# Altium project Relay_Board.PrjPcb
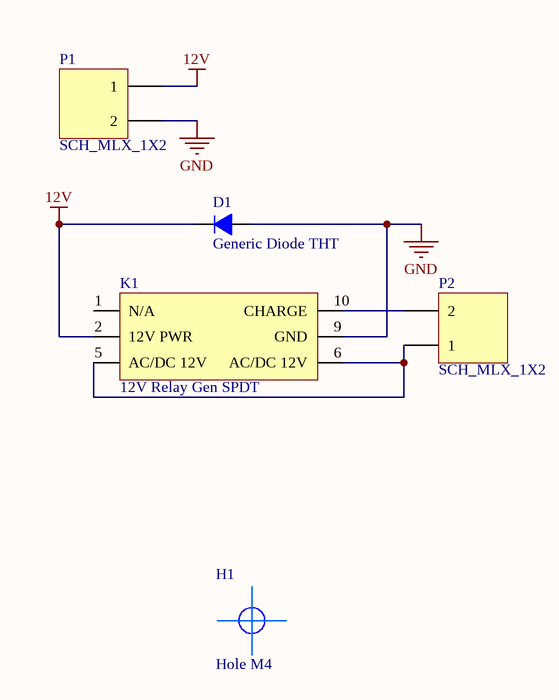
[diagram p0: Relay_Board.SchDoc]
1 sheet, 5 parts. Net scope: global (net labels, ports and power ports of the same name join across sheets).
Board file: Relay_Board.PcbDoc

## Sheet Relay_Board.SchDoc
size A4

### Parts
D1  Generic Diode THT  [Generic Diode THT]
H1  Hole M4  [#10Hole]
K1  12V Relay Gen SPDT  [12V Relay Gen SPDT]
P1  SCH_MLX_1X2  [PCB_MLX_MICROFIT_1X2]
P2  SCH_MLX_1X2  [PCB_MLX_MICROFIT_1X2]

### Nets
12V: D1.2 K1.2(12V_PWR) P1.1
GND: D1.1 K1.9(GND) P1.2
NetK1_5: K1.5(AC/DC_12V) K1.6(AC/DC_12V) P2.1
NetK1_10: K1.10(CHARGE) P2.2

Not connected (* = marked no-connect by the designer): K1 1(N/A)

### Library data of the parts
H1 = #10Hole